# Altium schematic sheet MS5837 for Cal V1.0.SchDoc
size A4
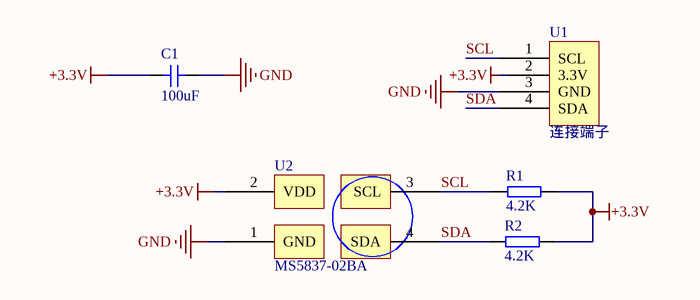
[diagram p0: MS5837 for Cal V1.0.SchDoc]

## Parts
C1  100uF  [0603C]
R1  4.2K  [0603R]
R2  4.2K  [0603R]
U1  连接端子  [连接端子]
U2  MS5837-02BA  [MS5837-02BA]

## Nets
+3.3V: C1.1 R1.2 R2.2 U1.2(3.3V) U2.2(VDD)
GND: C1.2 U1.3(GND) U2.1(GND)
SCL: R1.1 U1.1(SCL) U2.3(SCL)
SDA: R2.1 U1.4(SDA) U2.4(SDA)

## Library data of the parts
C1 = Cap1: 无极贴片电容
R1 R2 = Res: 电阻